# EAGLE design LCD_KM31_flip (EAGLE 6.4)

## Sheet 1 of 2
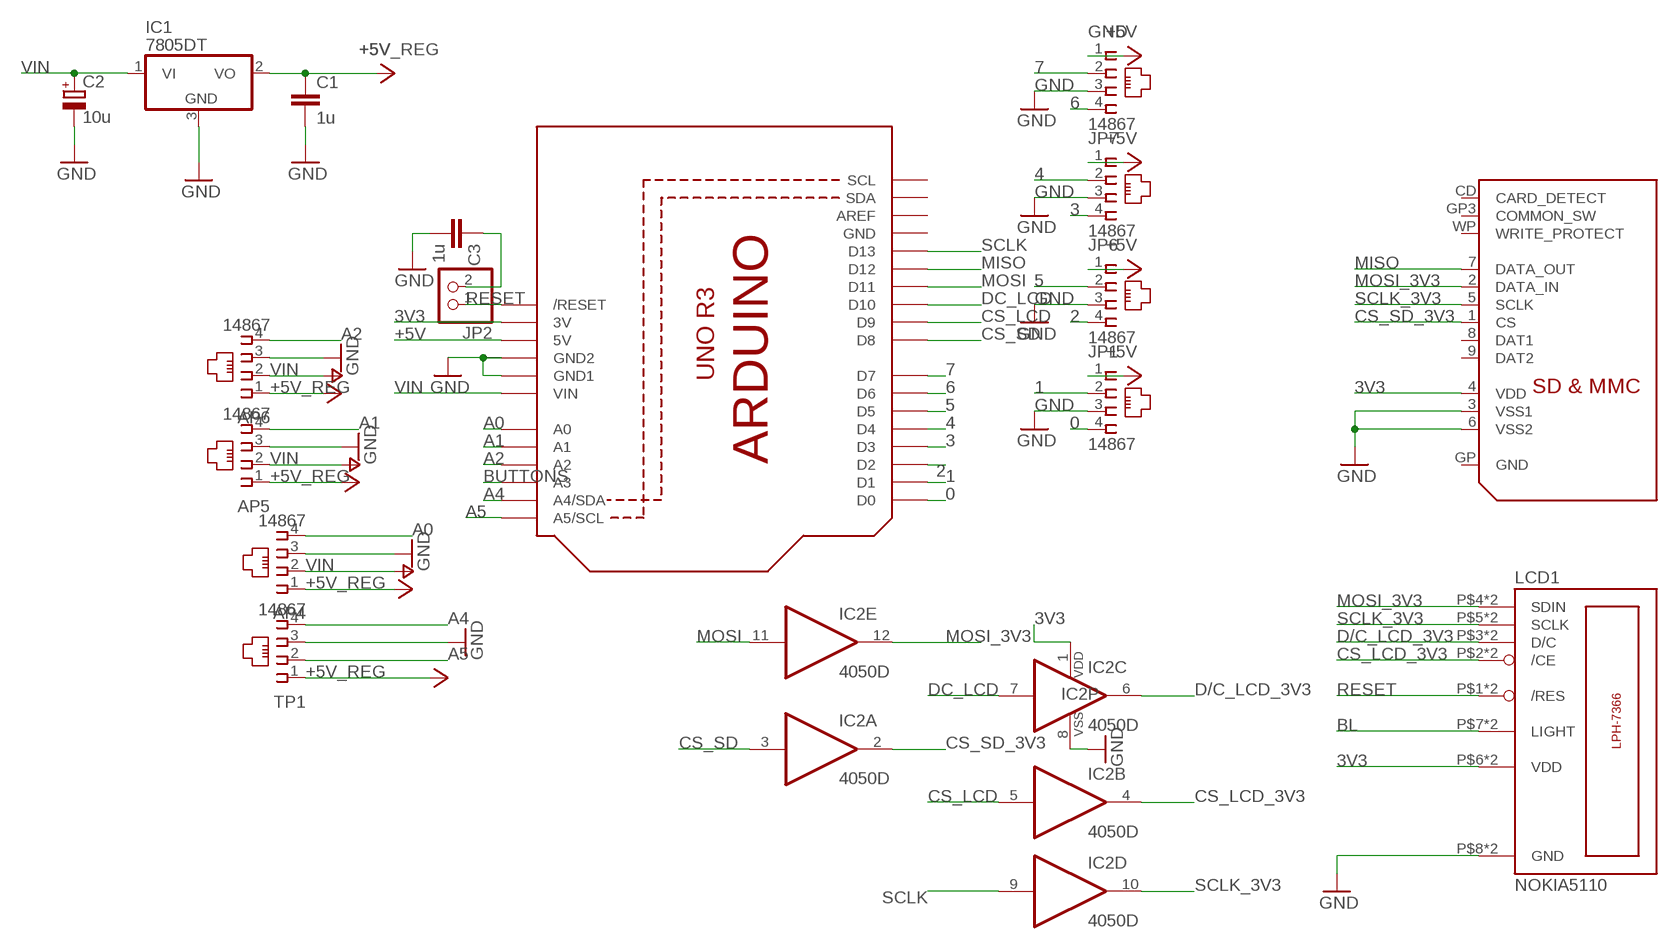
[diagram p0: schematic, sheet 1]

### Parts
AP4  14867  [14867]
AP5  14867  [14867]
AP6  14867  [14867]
C1  1u  C-EUC1206  [C1206]
C2  10u  CPOL-EUSMCC  [SMC_C]
C3  1u  C-EUC1206  [C1206]
GND  14867  [14867]
IC1  7805DT  [TO252]
IC2  4050D  [SO16]
JP1  14867  [14867]
JP2  PINHD-1X2  [1X02]
JP6  14867  [14867]
JP7  14867  [14867]
LCD1  NOKIA5110  LPH-7366  [LPH-7366]
TP1  14867  [14867]
U$1  ARDUINOR3-NOIOREF-NOTEXT  [ARDUINOR3-NOTEXT-NOIOREF]
U$2  SDMMC06132  [06132]

### Nets
0: JP1.4 U$1.D0
1: JP1.2 U$1.D1
2: JP6.4 U$1.D2
3: JP7.4 U$1.D3
3V3: IC2.1(P:VDD) LCD1.P$6(VDD) LCD1.P$14(VDD) U$1.3V U$2.4(VDD)
4: JP7.2 U$1.D4
5: JP6.2 U$1.D5
6: GND.4 U$1.D6
7: GND.2 U$1.D7
+5V: GND.1 JP1.1 JP6.1 JP7.1 U$1.5V ; also sheet 2
+5V_REG: AP4.1 AP5.1 AP6.1 C1.1 IC1.2(VO) TP1.1 ; supply symbol labelled +5V
A0: AP4.4 U$1.A0
A1: AP5.4 U$1.A1
A2: AP6.4 U$1.A2
A4: TP1.4 U$1.A4(A4/SDA)
A5: TP1.2 U$1.A5(A5/SCL)
BL: LCD1.P$7(LIGHT) LCD1.P$15(LIGHT) ; also sheet 2
BUTTONS: U$1.A3 ; also sheet 2
CS_LCD: IC2.5(B:I) U$1.D9
CS_LCD_3V3: IC2.4(B:O) LCD1.P$2(/CE) LCD1.P$10(/CE)
CS_SD: IC2.3(A:I) U$1.D8
CS_SD_3V3: IC2.2(A:O) U$2.1(CS)
D/C_LCD_3V3: IC2.6(C:O) LCD1.P$3(D/C) LCD1.P$11(D/C)
DC_LCD: IC2.7(C:I) U$1.D10
GND: AP4.3 AP5.3 AP6.3 C1.2 C2.- C3.2 GND.3 IC1.3(GND) IC2.8(P:VSS) JP1.3 JP6.3 JP7.3 LCD1.P$8(GND) LCD1.P$16(GND) TP1.3 U$1.GND1 U$1.GND2 U$2.3(VSS1) U$2.6(VSS2) ; also sheet 2
MISO: U$1.D12 U$2.7(DATA_OUT)
MOSI: IC2.11(E:I) U$1.D11
MOSI_3V3: IC2.12(E:O) LCD1.P$4(SDIN) LCD1.P$12(SDIN) U$2.2(DATA_IN)
N$10: C3.1 JP2.2
RESET: JP2.1 LCD1.P$1(/RES) LCD1.P$9(/RES) U$1.RESET(/RESET)
SCLK: IC2.9(D:I) U$1.D13
SCLK_3V3: IC2.10(D:O) LCD1.P$5(SCLK) LCD1.P$13(SCLK) U$2.5(SCLK)
VIN: AP4.2 AP5.2 AP6.2 C2.+ IC1.1(VI) U$1.VIN ; supply symbol labelled V+
Unconnected: IC2.14(F:I) IC2.15(F:O) U$1.AREF U$1.SCL U$1.SDA U$2.8(DAT1) U$2.9(DAT2) U$2.CD(CARD_DETECT) U$2.GP3(COMMON_SW) U$2.GP(GND) U$2.WP(WRITE_PROTECT)

## Sheet 2 of 2
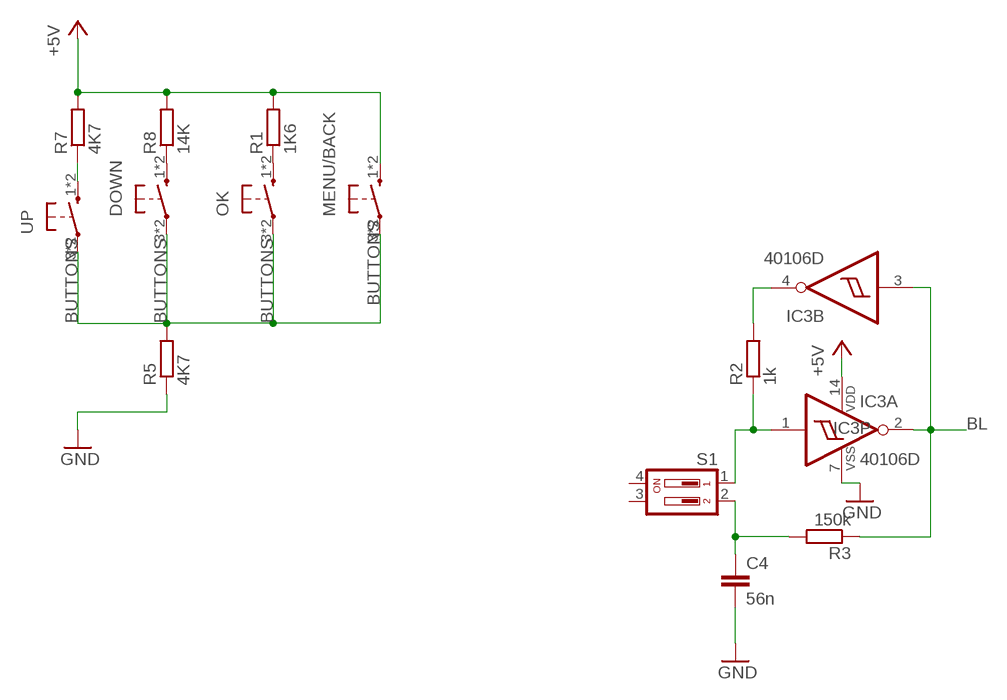
[diagram p1: schematic, sheet 2]

### Parts
C4  56n  C-EUC0805  [C0805]
DOWN  10-XX  [B3F-10XX]
IC3  40106D  [SO14]
MENU/BACK  10-XX  [B3F-10XX]
OK  10-XX  [B3F-10XX]
R1  1K6  R-EU_M0805  [M0805]
R2  1k  R-EU_R0805W  [R0805W]
R3  150k  R-EU_R0805W  [R0805W]
R5  4K7  R-EU_M0805  [M0805]
R7  4K7  R-EU_M0805  [M0805]
R8  14K  R-EU_M0805  [M0805]
S1  SD4-02  [SD4-02]
UP  10-XX  [B3F-10XX]

### Nets
+5V: IC3.14(P:VDD) MENU/BACK.1(S) MENU/BACK.2(S) R1.2 R7.2 R8.2 ; also sheet 1
BL: IC3.2(A:O) IC3.3(B:I) R3.1 ; also sheet 1
BUTTONS: DOWN.3(P) DOWN.4(P) MENU/BACK.3(P) MENU/BACK.4(P) OK.3(P) OK.4(P) R5.2 UP.3(P) UP.4(P) ; also sheet 1
GND: C4.2 IC3.7(P:VSS) R5.1 ; also sheet 1
N$1: DOWN.1(S) DOWN.2(S) R8.1
N$2: OK.1(S) OK.2(S) R1.1
N$3: R7.1 UP.1(S) UP.2(S)
N$4: C4.1 R3.2 S1.2
N$13: IC3.1(A:I) R2.1 S1.1
N$14: IC3.4(B:O) R2.2
Unconnected: IC3.5(C:I) IC3.6(C:O) IC3.8(D:O) IC3.9(D:I) IC3.10(E:O) IC3.11(E:I) IC3.12(F:O) IC3.13(F:I) S1.3 S1.4

## Power pins joined to a net without a drawn wire
GND: U$1.GND

## Library data of the parts
AP4-AP6 GND JP1 JP6 JP7 TP1 = RJ11:14867: RJ11 Connector Source: 4UCON TECHNOLOGY INC. 14867.pdf; OC_FARNELL: unknown; OC_NEWARK: unknown
C1 C3 C4 = rcl:C-EU: CAPACITOR, European symbol
C2 = rcl:CPOL-EU: POLARIZED CAPACITOR, European symbol
DOWN MENU/BACK OK UP = Sensuino:10-XX: OMRON SWITCH
IC1 = Sensuino:78*: Positive VOLTAGE REGULATOR Source: http://cache.national.com/ds/LM/LM78L05.pdf http://www.fairchildsemi.com/ds/LM/LM7805.pdf
IC2 = 40xx:4050: Hex non-inverting BUFFER
IC3 = 40xx:40106: Hex SCHMITT TRIGGER
JP2 = pinhead:PINHD-1X2: PIN HEADER
LCD1 = Sensuino:LPH-7366
R1-R3 R5 R7 R8 = rcl:R-EU_: RESISTOR, European symbol
S1 = Sensuino:SD4-02: DIL/CODE SWITCH; OC_FARNELL: unknown; OC_NEWARK: unknown
U$1 = adafruit:ARDUINOR3-NOIOREF
U$2 = adafruit:SDMMC: SD MMC Card holder 4UCON part #06132 - easy to solder

## Board
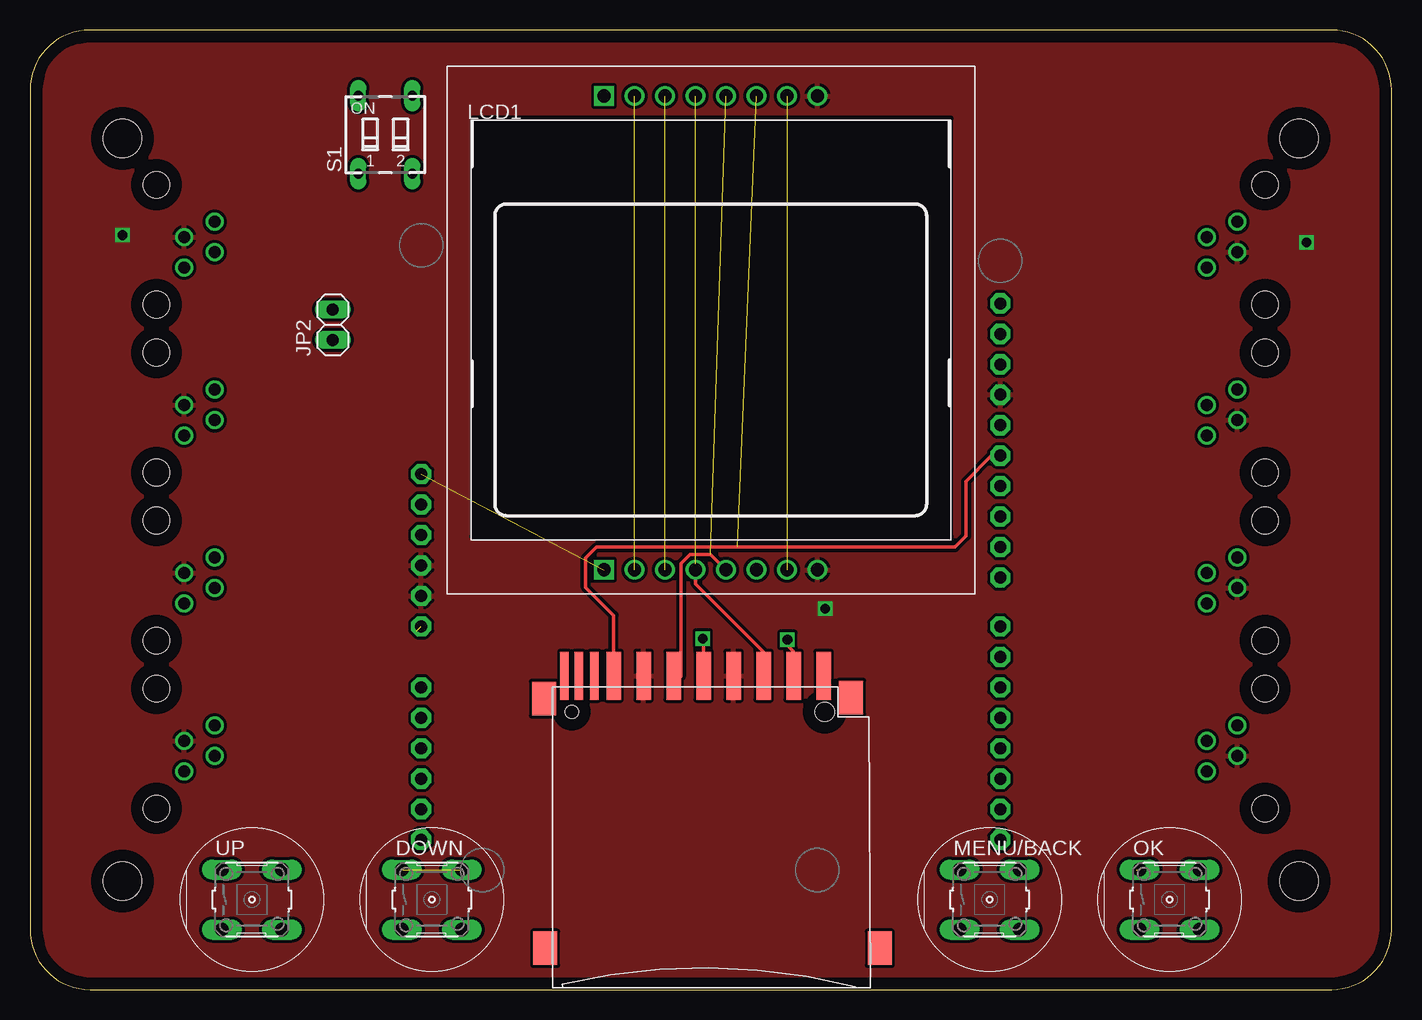
[diagram p2: board, top side]
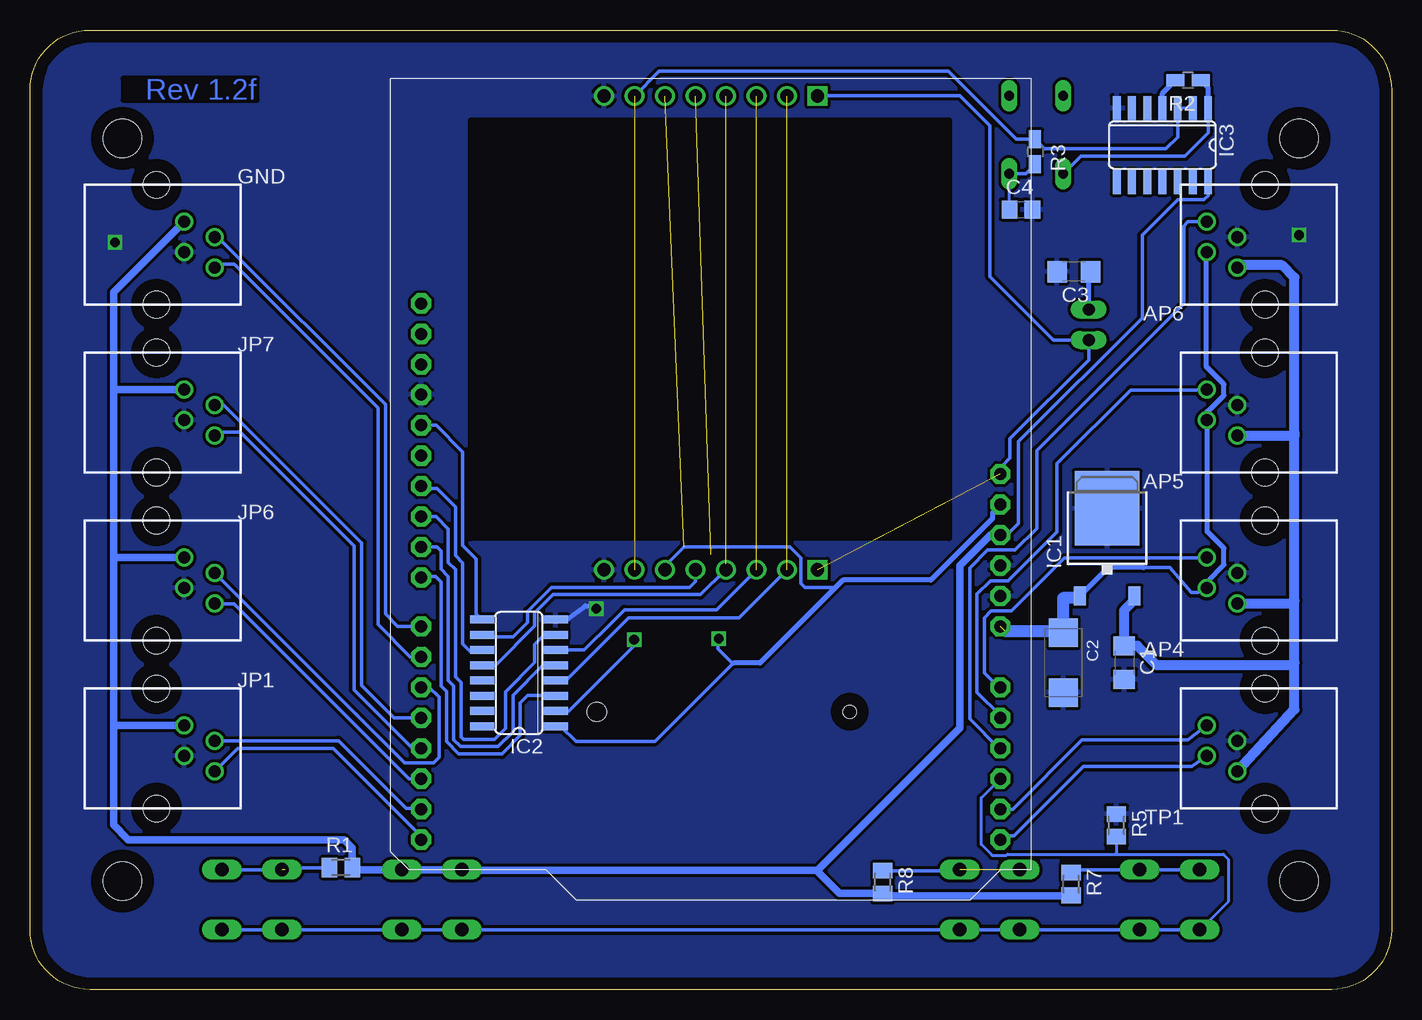
[diagram p3: board, bottom side, seen from below]

Size 113.5 x 80 mm. Coordinates in mm from the lower left corner, seen from the top.
Outline: 0,75 0,5 arc90 5,0 108.5,0 arc90 113.5,5 113.5,75 arc90 108.5,80 5,80 arc90 0,75
Copper layers (1*16): Top 0.035mm / dielectric 1.5mm / Bottom 0.035mm
Design rules "default": minimum track width 10mil, minimum drill 24mil, track to track 8mil, track to pad 8mil, pad to pad 8mil, via to via 8mil, smd to smd 8mil, copper to edge 40mil, drill to drill 8mil, minimum pad ring 10mil, minimum via ring 8mil, stop-mask expansion 4mil, vias tented up to drill 0mil, thermal gap 10mil
Holes 3.2 mm at 7.7,9.05 7.7,70.95 105.8,70.95 105.8,9.05
tRestrict: area 36.9,37.8 to 76.7,72.6
bRestrict: area 36.9,37.6 to 76.7,72.5

### Footprints (pad centres in the part's own frame; a part is rotated, then mirrored left to right if it is on the bottom)
14867 = drill 1 pad 1.422: 1 -1.905,6.35; 2 -0.635,8.89; 3 0.635,6.35; 4 1.905,8.89 | hole 2.2: -5,4.05; 5,4.05
C1206 = smd 1.6 x 1.8: 1 -1.4,0; 2 1.4,0
SMC_C = smd 2.4 x 2.4: + -2.5,0; - 2.5,0
C0805 = smd 1.3 x 1.5: 1 -0.95,0; 2 0.95,0
B3F-10XX = drill 1.1 long: 1 -2.5,2.5; 2 2.5,2.5; 3 -2.5,-2.5; 4 2.5,-2.5
TO252 = smd 1 x 1.6: 1 -2.28,-4.8; 2 2.28,-4.8 | smd 5.4 x 6.2: 3 0,2.5
SO16 = smd 0.66 x 2.032: 1 -4.445,-3.073; 2 -3.175,-3.073; 3 -1.905,-3.073; 4 -0.635,-3.073; 5 0.635,-3.073; 6 1.905,-3.073; 7 3.175,-3.073; 8 4.445,-3.073; 9 4.445,3.073; 10 3.175,3.073; 11 1.905,3.073; 12 0.635,3.073; 13 -0.635,3.073; 14 -1.905,3.073; 15 -3.175,3.073; 16 -4.445,3.073
SO14 = smd 0.66 x 2.032: 1 -3.81,-3.073; 2 -2.54,-3.073; 3 -1.27,-3.073; 4 0,-3.073; 5 1.27,-3.073; 6 2.54,-3.073; 7 3.81,-3.073; 8 3.81,3.073; 9 2.54,3.073; 10 1.27,3.073; 11 0,3.073; 12 -1.27,3.073; 13 -2.54,3.073; 14 -3.81,3.073
1X02 = drill 1 long: 1 -1.27,0; 2 1.27,0
LPH-7366 = drill 1.1 square: P$1 -8.89,-18.5; P$9 -8.89,21 | drill 1.1: P$2 -6.35,-18.5; P$3 -3.81,-18.5; P$4 -1.27,-18.5; P$5 1.27,-18.5; P$6 3.81,-18.5; P$7 6.35,-18.5; P$8 8.89,-18.5; P$10 -6.35,21; P$11 -3.81,21; P$12 -1.27,21; P$13 1.27,21; P$14 3.81,21; P$15 6.35,21; P$16 8.89,21
M0805 = smd 1.3 x 1.6: 1 -0.95,0; 2 0.95,0
R0805W = smd 1.5 x 1: 1 -1.052,0; 2 1.052,0
SD4-02 = drill 0.813 long: 1 -2.25,-3.25; 2 2.25,-3.25; 3 2.25,3.25; 4 -2.25,3.25
ARDUINOR3-NOTEXT-NOIOREF = drill 1 pad 1.676 octagon: 3V 35.56,2.54; 5V 38.1,2.54; A0 50.8,2.54; A1 53.34,2.54; A2 55.88,2.54; A3 58.42,2.54; A4 60.96,2.54; A5 63.5,2.54; AREF 23.876,50.8; D0 63.5,50.8; D1 60.96,50.8; D2 58.42,50.8; D3 55.88,50.8; D4 53.34,50.8; D5 50.8,50.8; D6 48.26,50.8; D7 45.72,50.8; D8 41.656,50.8; D9 39.116,50.8; D10 36.576,50.8; D11 34.036,50.8; D12 31.496,50.8; D13 28.956,50.8; GND 26.416,50.8; GND1 43.18,2.54; GND2 40.64,2.54; RESET 33.02,2.54; SCL 18.796,50.8; SDA 21.336,50.8; VIN 45.72,2.54
06132 = smd 1.2 x 4: 1 6.9,0.9; 2 4.4,0.9; 3 1.9,0.9; 4 -0.6,0.9; 5 -3.1,0.9; 6 -5.6,0.9; 7 -8.1,0.9; 9 9.4,0.9 | smd 0.7 x 4: 8 -9.7,0.9; CD -11,0.9; WP -12.2,0.9 | smd 2 x 2.8: GP -13.8,-21.8; GP2 14.1,-21.8; GP3 11.7,-0.9; GP4 -13.9,-1 | hole 1.1: -11.6,-2.1 | hole 1.6: 9.5,-2.1

### Placement (x,y rotation side)
AP4  6.5,34.1 90 bottom
AP5  6.5,48.1 90 bottom
AP6  6.5,62.1 90 bottom
C1  22.28,27.25 270 bottom
C2  27.36,27.25 270 bottom
C3  26.48,59.84 180 bottom
C4  30.89,65.02 0 bottom
DOWN  33.5,7.5 0 top
GND  107,62.1 270 bottom
IC1  23.7,37.62 0 bottom
IC2  72.74,26.4 90 bottom
IC3  19.1,70.41 180 bottom
JP1  107,20.1 270 bottom
JP2  25.24,55.42 90 top
JP6  107,34.1 270 bottom
JP7  107,48.1 270 bottom
LCD1  56.75,53.5 0 top
MENU/BACK  80,7.5 0 top
OK  95,7.5 0 top
R1  87.58,10.16 0 bottom
R2  16.97,75.79 180 bottom
R3  29.72,69.85 270 bottom
R5  22.94,13.69 270 bottom
R7  26.71,8.8 270 bottom
R8  42.42,8.95 270 bottom
S1  29.62,71.27 0 top
TP1  6.5,20.1 90 bottom
U$1  30.08,76 270 top
U$2  56.75,25.25 0 top
UP  18.5,7.5 0 top

### Tracks (layer width: path | path; a pad name or v marks a point on that pad's centre or on a via)
0
  Bottom 0.305: U$1.D0 80.88,12.76 88.24,20.12 96.19,20.12 JP1.4
1
  Bottom 0.305: JP1.2 87.79,20.73 82.14,15.09 80.93,15.09 U$1.D1
2
  Bottom 0.305: U$1.D2 81.89,17.58 96.47,32.16 98.07,32.16 JP6.4
3
  Bottom 0.305: U$1.D3 81.62,20.12 86.5,25 86.5,37 96,46.5 97.81,46.5 JP7.4
3V3  (via drill 0.8)  (1 unrouted)
  Top 0.305: U$2.4 56.15,29.19 v56.08,29.26
  Bottom 0.254: 33.26,39.8 U$1.3V
  Bottom 0.305: U$1.3V 32.62,40.58 | LCD1.P$6 60.56,35.3 58.98,36.88 50.14,36.88 49.23,35.97 49.23,33.86 48.9,33.53 46.61,33.53 46.47,33.39 | IC2.1 69.25,21.95 68,20.7 61.39,20.7 54.86,27.23 55,27.23 56.15,28.38 56.15,29.19 v56.08,29.26
  Bottom 0.406: 33.26,39.8 33.26,39.28 38.41,34.14 45.72,34.14 46.47,33.39 52.63,27.23 54.86,27.23
4
  Bottom 0.305: JP7.2 97.35,48.73 85.85,37.24 85.85,25.35 83.16,22.66 U$1.D4
5
  Bottom 0.305: U$1.D5 80.22,25.2 79.4,24.38 79.4,19.36 79.86,18.9 82.27,18.9 JP6.2
6
  Bottom 0.305: GND.4 97.81,60.5 96.5,60.5 84.5,48.5 84.5,30.43 81.81,27.74 U$1.D6
7
  Bottom 0.305: GND.2 97.96,62.59 97.64,62.59 97.59,62.53 97.59,62.48 83.87,48.77 83.87,31.29 82.86,30.28 U$1.D7
+5V
  Bottom 0.254: 26.76,7.8 R7.2
  Bottom 0.305: 86.56,10.23 R1.2 | U$1.5V 31.95,37.9 31.95,38 31.09,38.86 31.09,45.67 20.78,55.98 20.78,62.89 17.83,65.84 15.65,65.84 15.29,66.19 IC3.14
  Bottom 0.406: 77.46,9.96 MENU/BACK.1 | 86.47,10 R1.2 | 106.33,50.01 106.51,49.83 | 106.5,36.01 106.51,36.01 | 106.49,22 106.51,21.99
  Bottom 0.61: 77.46,9.96 47.95,9.96 47.88,9.88 | MENU/BACK.1 MENU/BACK.2 86.47,10 | 106.51,21.99 106.51,22.55 | 106.51,22.55 106.51,36.01 106.51,49.83 106.51,58.15 GND.1 | JP7.1 106.33,50.01 | JP6.1 106.5,36.01 | JP1.1 106.49,22 | R1.2 86.63,11.8 87.33,12.5 105.31,12.5 106.53,13.72 106.53,22.53 106.51,22.55 | 47.88,9.88 46,8 R8.2 42.22,7.8 26.76,7.8 | U$1.5V 33.42,37.9 35.97,35.36 35.97,21.79 47.88,9.88
+5V_REG
  Bottom 0.406: 13.04,60.39 AP6.1 | 8.33,46.4 8.1,46.16
  Bottom 0.813: TP1.1 8.1,23.35 8.1,27.26 | 8.1,27.26 8.1,32.4 | 8.1,32.4 8.1,46.16 8.1,46.4 | 8.1,46.4 8.1,59.37 9.11,60.39 13.04,60.39 | IC1.2 21.42,32.48 22.3,31.6 22.3,29.77 C1.1 21.18,28.65 19.55,27.03 8.33,27.03 8.1,27.26 | AP4.1 8.3,32.2 8.1,32.4 | AP5.1 8.3,46.2 8.1,46.4
A0
  Bottom 0.305: AP4.4 15.43,35.97 27.28,35.97 31.7,31.55 33.38,31.55 33.93,30.99 33.93,26.42 32.72,25.2 U$1.A0
A1
  Bottom 0.305: AP5.4 15.41,49.99 21.74,49.99 27.89,43.84 27.89,38.15 31.98,34.06 33.45,34.06 34.54,32.97 34.54,24.79 32.62,22.87 U$1.A1
A2
  Bottom 0.305: U$1.A2 32.72,20.12 35.15,22.55 35.15,35.15 33.68,36.63 31.39,36.63 29.57,38.46 29.57,44.96 17.32,57.2 17.32,63.65 16.97,64.01 AP6.4
A4
  Bottom 0.305: U$1.A4 31.56,15.04 25.8,20.8 17,20.8 TP1.4
A5
  Bottom 0.305: TP1.2 16.66,18.6 25.7,18.6 31.5,12.8 32.32,12.8 U$1.A5
BL  (1 unrouted)
  Bottom 0.254: IC3.2 IC3.3
  Bottom 0.305: LCD1.P$15 61.04,76.56 36.93,76.56 31.28,70.9 R3.1 28.92,70.1 18.8,70.1 17.83,71.07 IC3.3
BUTTONS
  Bottom 0.254: 15.93,5 13.61,7.32 13.61,10.87 14.02,11.28 22.86,11.28 | U$1.A3 34.2,16 34.2,12.1 33.33,11.23 33.27,11.18 32.11,11.18 32,11.28 22.86,11.28 | R5.2 22.94,11.36 22.86,11.28
  Bottom 0.305: OK.4 OK.3 MENU/BACK.4 MENU/BACK.3 DOWN.4 DOWN.3 UP.4 UP.3 15.93,5
CS_LCD
  Bottom 0.305: U$1.D9 79.56,36.88 79.25,36.58 79.25,35.05 78.64,34.44 78.64,25.76 78.18,25.3 78.18,20.83 77.61,20.25 74.47,20.25 73.25,21.47 73.25,24.52 70.81,26.96 69.74,26.96 IC2.5
CS_LCD_3V3  (1 unrouted)
  Bottom 0.305: IC2.4 69.53,25.9 68.7,25.9 64.73,29.87 64.72,29.87 63.6,30.99 54.41,30.99 LCD1.P$2
CS_SD
  Bottom 0.254: IC2.3
  Bottom 0.305: IC2.3 69.7,24.52 72.03,24.52 72.64,23.91 72.64,21.17 74.16,19.65 77.76,19.65 78.79,20.68 78.79,24.84 79.25,25.3 79.25,33.98 79.7,34.44 80.78,34.44 U$1.D8
CS_SD_3V3  (via drill 0.8)
  Top 0.305: 63.6,25.54 U$2.1 63.6,26.2 63.6,28.25 63.14,28.7 v63.14,29.16
  Top 0.406: U$2.1 63.6,25.49
  Bottom 0.305: IC2.2 68.58,23.22 63.6,28.2 63.2,28.6 63.2,29.11 v63.14,29.16
D/C_LCD_3V3  (1 unrouted)
  Bottom 0.305: IC2.6 67.3,28.3 65,30.6 65,30.61 63.96,31.65 56.29,31.65 LCD1.P$3
DC_LCD
  Bottom 0.305: U$1.D10 79.66,39.42 78.64,38.41 78.64,35.61 78.03,35 78.03,26.06 77.57,25.6 77.57,21.08 77.35,20.86 74.77,20.86 73.86,21.78 73.86,24.83 71.42,27.27 71.42,28.79 70.64,29.57 IC2.7
GND  (via drill 0.8)
  Bottom 0.406: IC2.8 68.74,30.84 67.2,32 66.54,32 v66.29,31.75
  other vias: 7.7,62.9 106.4,62.3
  pour Bottom (isolate 0.254): 1,1 1,79.06 112.39,79.06 112.39,1
  pour Top (isolate 0.254): 1,1.2 1,79.09 112.51,79.09 112.39,1.2
MISO
  Top 0.305: U$1.D12 80.17,44.5 78.03,42.37 78.03,37.8 77.11,36.88 47.24,36.88 46.33,35.97 46.33,33.53 48.65,31.21 U$2.7
MOSI
  Bottom 0.305: U$1.D11 80.67,41.76 79.55,41.76 78.03,40.23 78.03,36.17 77.42,35.56 77.42,28.8 76.86,28.25 75.87,28.25 IC2.11 76,28.48
MOSI_3V3  (1 unrouted)
  Top 0.254: 61.3,28 61.3,25.64 U$2.2
  Top 0.305: 61.3,28 55.48,33.82 LCD1.P$4
  Top 0.406: LCD1.P$4 55.48,35.48 | 61,25.64 U$2.2
  Bottom 0.305: IC2.12 74.7,27.03 71.42,30.31 71.42,31.38 69.88,32.92 57.61,32.92 55.53,35 LCD1.P$4
N$1  (1 unrouted)
  Bottom 0.305: R8.1 36.1,9.9 DOWN.2
N$2  (1 unrouted)
  Bottom 0.305: OK.2 92.21,10 92.05,10.16 R1.1
N$3
  Bottom 0.305: UP.1 UP.2 26.33,10 26.39,9.95 R7.1
N$4
  Bottom 0.254: C4.1 31.84,67.99 S1.2
  Bottom 0.305: S1.2 30.49,68.02 R3.2
N$10
  Bottom 0.406: JP2.2 25.24,59.68 C3.1
N$13
  Bottom 0.305: IC3.1 15.29,71.42 17.22,69.49 25.89,69.49 S1.1
  Bottom 0.406: IC3.1 15.29,75.17 R2.1
N$14
  Bottom 0.406: IC3.4 19.1,74.71 R2.2
RESET  (1 unrouted)
  Bottom 0.305: LCD1.P$9 47.84,74.52 35.97,74.52 33.48,72.03 33.48,59.44 28.19,54.15 JP2.1 25.25,52.48 31.8,45.92 31.8,44.3 32.62,43.48 U$1.RESET
SCLK
  Bottom 0.305: U$1.D13 79.66,47.04 77.42,44.81 77.42,37.03 76.3,35.92 76.3,33.37 76.3,33.36 76.3,31.32 IC2.9
SCLK_3V3  (1 unrouted)
  Top 0.305: U$2.5 54.25,26.1 54.25,35.51 55.02,36.27 56.75,36.27 LCD1.P$5
  Bottom 0.305: LCD1.P$5 58.02,34.03 58.52,33.53 70.03,33.53 72.03,31.53 72.03,30.62 73.25,29.4 75.64,29.4 IC2.10
VIN  (1 unrouted)
  Bottom 0.254: 27.3,32.68 27.3,30.28 27.3,30.2
  Bottom 0.305: IC1.1 25.66,32.82 | 20.66,35.18 18.48,35.18 16.7,33.1 16.16,33.1 AP4.2
  Bottom 0.406: 20.66,35.18 23.62,35.18 IC1.1 | AP6.2 15.44,61.41 15.44,51.94 13.97,50.47 13.97,49.53 15.29,48.21 15.39,48.21 AP5.2 15.39,38.23 13.97,36.81 13.97,35.43 15.37,34.04 15.37,33.49 AP4.2
  Bottom 1.016: IC1.1 26.12,32.68 27.3,32.68 27.36,32.62 C2.+ | 32.24,29.9 27.87,29.9 27.84,29.87 27.71,29.87 27.3,30.28

### Text on the board
Bottom: Rev 1.2f
200bmp: A3 | D4 | A2 | D3 | A1 | D2 | SENSUINO | I2C | D1